# Altium schematic sheet Bank2_Configuration.SchDoc
size A4
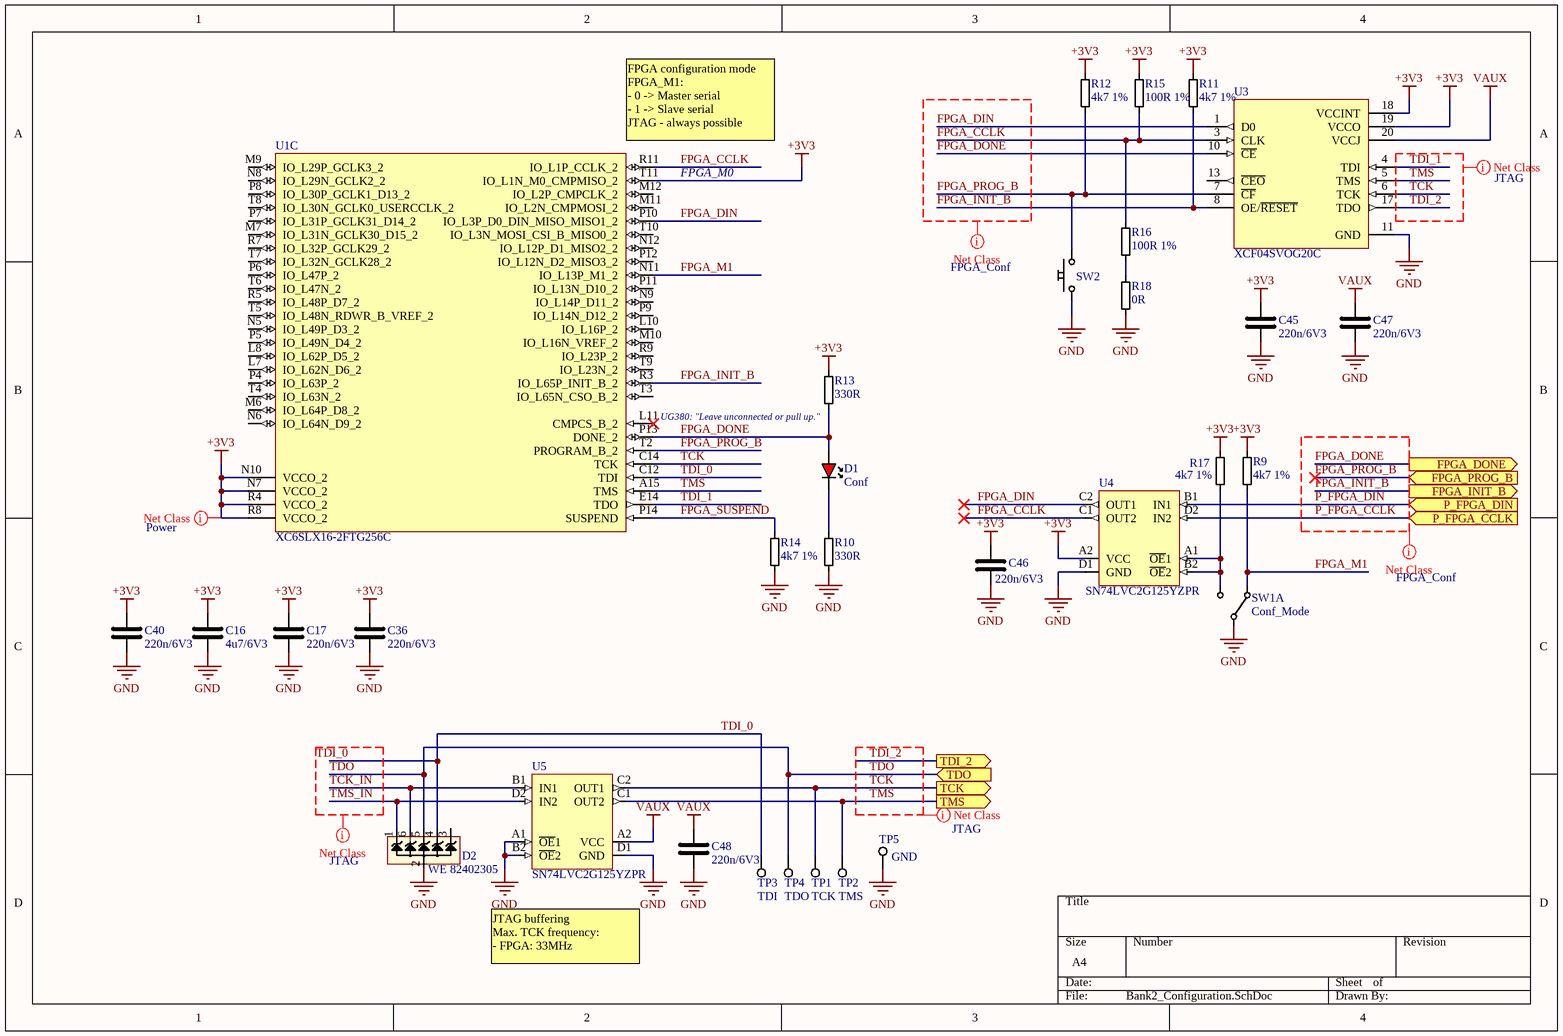
[diagram p0: Bank2_Configuration.SchDoc]

## Parts
C16  4u7/6V3  [C0805_N]
C17  220n/6V3  [C0402_N]
C36  220n/6V3  [C0402_N]
C40  220n/6V3  [C0402_N]
C45  220n/6V3  [C0402_N]
C46  220n/6V3  [C0402_N]
C47  220n/6V3  [C0402_N]
C48  220n/6V3  [C0402_N]
D1  Conf  [LED0603_red_N]
D2  WE 82402305  [SOT23-6_N]
R9  4k7 1%  [R0402_N]
R10  330R  [R0402_N]
R11  4k7 1%  [R0402_N]
R12  4k7 1%  [R0402_N]
R13  330R  [R0402_N]
R14  4k7 1%  [R0402_N]
R15  100R 1%  [R0402_N]
R16  100R 1%  [R0402_N]
R17  4k7 1%  [R0402_N]
R18  0R  [R0402_N]
SW1  Conf_Mode  [JS202011AQN]  (part A of 2)
SW2  SW 4,3mm 1,5N SMD  [SW4,3SMD]  (value not drawn)
TP1  TCK  [TP_20mil_SMT]
TP2  TMS  [TP_20mil_SMT]
TP3  TDI  [TP_20mil_SMT]
TP4  TDO  [TP_20mil_SMT]
TP5  GND  [TP_20mil_SMT]
U1  XC6SLX16-2FTG256C  [Xilinx_FT256_L]  (part C of 5)
U3  XCF04SVOG20C  [Xilinx_TSOP20_N]
U4  SN74LVC2G125YZPR  [TI_YZP8]
U5  SN74LVC2G125YZPR  [TI_YZP8]

## Ports
FPGA_DONE (out), FPGA_INIT_B (out), FPGA_PROG_B (in), P_FPGA_CCLK (in), P_FPGA_DIN (in), TCK (out), TDI_2 (out), TDO (in), TMS (out)

## Nets
+3V3: C16.2 C17.2 C36.2 C40.2 C45.2 C46.2 R9.1 R11.1 R12.1 R13.1 R15.1 R17.1 U1.N7(VCCO_2) U1.N10(VCCO_2) U1.R4(VCCO_2) U1.R8(VCCO_2) U1.T11(IO_L1N_M0_CMPMISO_2) U3.18(VCCINT) U3.19(VCCO) U4.A2(VCC)
GND: C16.1 C17.1 C36.1 C40.1 C45.1 C46.1 C47.1 C48.1 D2.2(A1) R10.2 R14.2 R18.2 SW1.COM1 SW2.1 TP5.1 U3.11(GND) U4.D1(GND) U5.A1(~{OE}1) U5.B2(~{OE}2) U5.D1(GND)
VAUX: C47.2 C48.2 U3.20(VCCJ) U5.A2(VCC)
FPGA_CCLK: R15.2 R16.1 U1.R11(IO_L1P_CCLK_2) U3.3(CLK) U4.C1(OUT2)
FPGA_DIN: U1.P10(IO_L3P_D0_DIN_MISO_MISO1_2) U3.1(D0) U4.C2(OUT1)
FPGA_DONE: D1.1 R13.2 U1.P13(DONE_2) U3.10(~{CE}) ; port FPGA_DONE
FPGA_INIT_B: R11.2 U1.R3(IO_L65P_INIT_B_2) U3.8(OE/~{RESET}) ; port FPGA_INIT_B
FPGA_M1: R9.2 SW1.NC1 U1.N11(IO_L13P_M1_2)
FPGA_PROG_B: R12.2 SW2.2 U1.T2(PROGRAM_B_2) U3.7(~{CF}) ; port FPGA_PROG_B
FPGA_SUSPEND: R14.1 U1.P14(SUSPEND)
P_FPGA_CCLK: U4.D2(IN2) ; port P_FPGA_CCLK
P_FPGA_DIN: U4.B1(IN1) ; port P_FPGA_DIN
TCK: TP1.1 U1.C14(TCK) U3.6(TCK) U5.C2(OUT1) ; port TCK
TCK_IN: D2.6(C4) U5.B1(IN1)
TDI_0: D2.4(C3) TP3.1 U1.C12(TDI)
TDI_1: U1.E14(TDO) U3.4(TDI)
TDI_2: U3.17(TDO) ; port TDI_2
TDO: D2.5(A2) TP4.1 ; port TDO
TMS: TP2.1 U1.A15(TMS) U3.5(TMS) U5.C1(OUT2) ; port TMS
TMS_IN: D2.1(C1) U5.D2(IN2)
NetD1_2: D1.2 R10.1
NetR16_2: R16.2 R18.1
NetR17_2: R17.2 SW1.NO1 U4.A1(~{OE}1) U4.B2(~{OE}2)

Not connected (* = marked no-connect by the designer): D2 3(C2); U1 L7(IO_L62N_D6_2) L8(IO_L62P_D5_2) L10(IO_L16P_2) L11(CMPCS_B_2)* M6(IO_L64P_D8_2) M7(IO_L31N_GCLK30_D15_2) M9(IO_L29P_GCLK3_2) M10(IO_L16N_VREF_2) M11(IO_L2N_CMPMOSI_2) M12(IO_L2P_CMPCLK_2) N5(IO_L49P_D3_2) N6(IO_L64N_D9_2) N8(IO_L29N_GCLK2_2) N9(IO_L14P_D11_2) N12(IO_L12P_D1_MISO2_2) P4(IO_L63P_2) P5(IO_L49N_D4_2) P6(IO_L47P_2) P7(IO_L31P_GCLK31_D14_2) P8(IO_L30P_GCLK1_D13_2) P9(IO_L14N_D12_2) P11(IO_L13N_D10_2) P12(IO_L12N_D2_MISO3_2) R5(IO_L48P_D7_2) R7(IO_L32P_GCLK29_2) R9(IO_L23P_2) T3(IO_L65N_CSO_B_2) T4(IO_L63N_2) T5(IO_L48N_RDWR_B_VREF_2) T6(IO_L47N_2) T7(IO_L32N_GCLK28_2) T8(IO_L30N_GCLK0_USERCCLK_2) T9(IO_L23N_2) T10(IO_L3N_MOSI_CSI_B_MISO0_2); U3 13(~{CEO})

## Layout directives
net class Power: +3V3
net class FPGA_Conf: FPGA_CCLK, FPGA_DIN, FPGA_DONE, FPGA_INIT_B, FPGA_PROG_B, P_FPGA_CCLK, P_FPGA_DIN
net class JTAG: TCK, TCK_IN, TDI_0, TDI_1, TDI_2, TDO, TMS, TMS_IN

## Notes on the sheet
- (near U1) FPGA configuration mode
  FPGA_M1:
  - 0 -> Master serial
  - 1 -> Slave serial
  JTAG - always possible
- FPGA_M0
- (near R13) UG380: "Leave unconnected or pull up."
- JTAG buffering
  Max. TCK frequency:
  - FPGA: 33MHz
- Labels drawn without touching a wire or pin: TDI_0

## Library data of the parts
C16 C17 C36 C40 C45-C48 = C
D1 = LED_0603_Red_Super_Bright: Generic 0603 Super Bright Red LED
D2 = WE 82402305: TVS Diode WE-TVS-Standard, VRWM=5.0V; Manufacturer 1: Wurth Elektronik; Reverse Stand Off Voltage: 5V; ComponentLink2Description: Datasheet; ComponentLink2URL: http://katalog.we-online.de/kataloge/eisos/media/pdf/82402305.pdf; Manufacturer Part Number 1: 82402305
R9-R18 = R
SW1 = JS202011AQN
SW2 = SW 4,3mm 1,5N SMD: Microswitch 4,3mm; Manufacturer Part Number 1: KSC721G LFS; Manufacturer 1: C&K Components; Supplier 1: Mouser; Supplier Part Number 1: 611-KSC721GLFS; Type: Inne
TP1-TP5 = TP
U3 = XCF04SVOG20C: Xilinx Platform Flash configuration memory 4Mbit